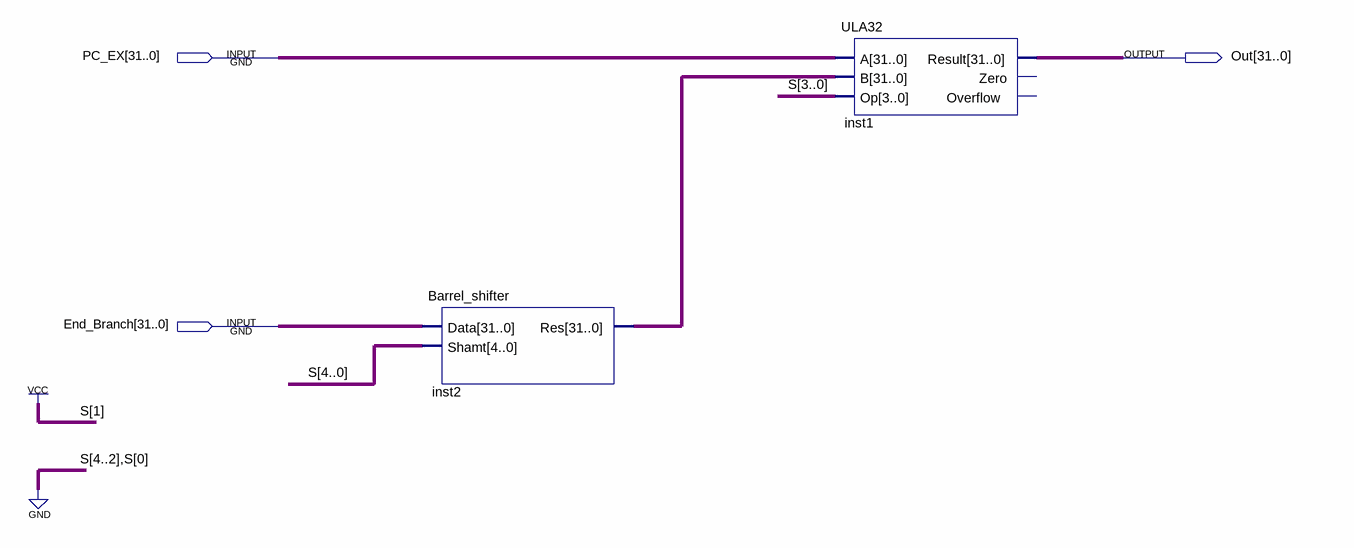
[diagram p0: schematic sheet]
// Quartus schematic Unidade_Branch.bdf as structural Verilog: 2 symbols, 3 pins
module Unidade_Branch (
  input  [31:0] PC_EX,
  input  [31:0] End_Branch,
  output [31:0] Out
);

  wire [31:0] inst2_res;

  Barrel_shifter inst2 (.Data(End_Branch), .Shamt(5'b00010), .Res(inst2_res));
  ULA32 inst1 (.A(PC_EX), .B(inst2_res), .Op(4'b0010), .Result(Out));  // open: Zero, Overflow
endmodule
